# EAGLE design Wii U GamePad (EAGLE 6.2)
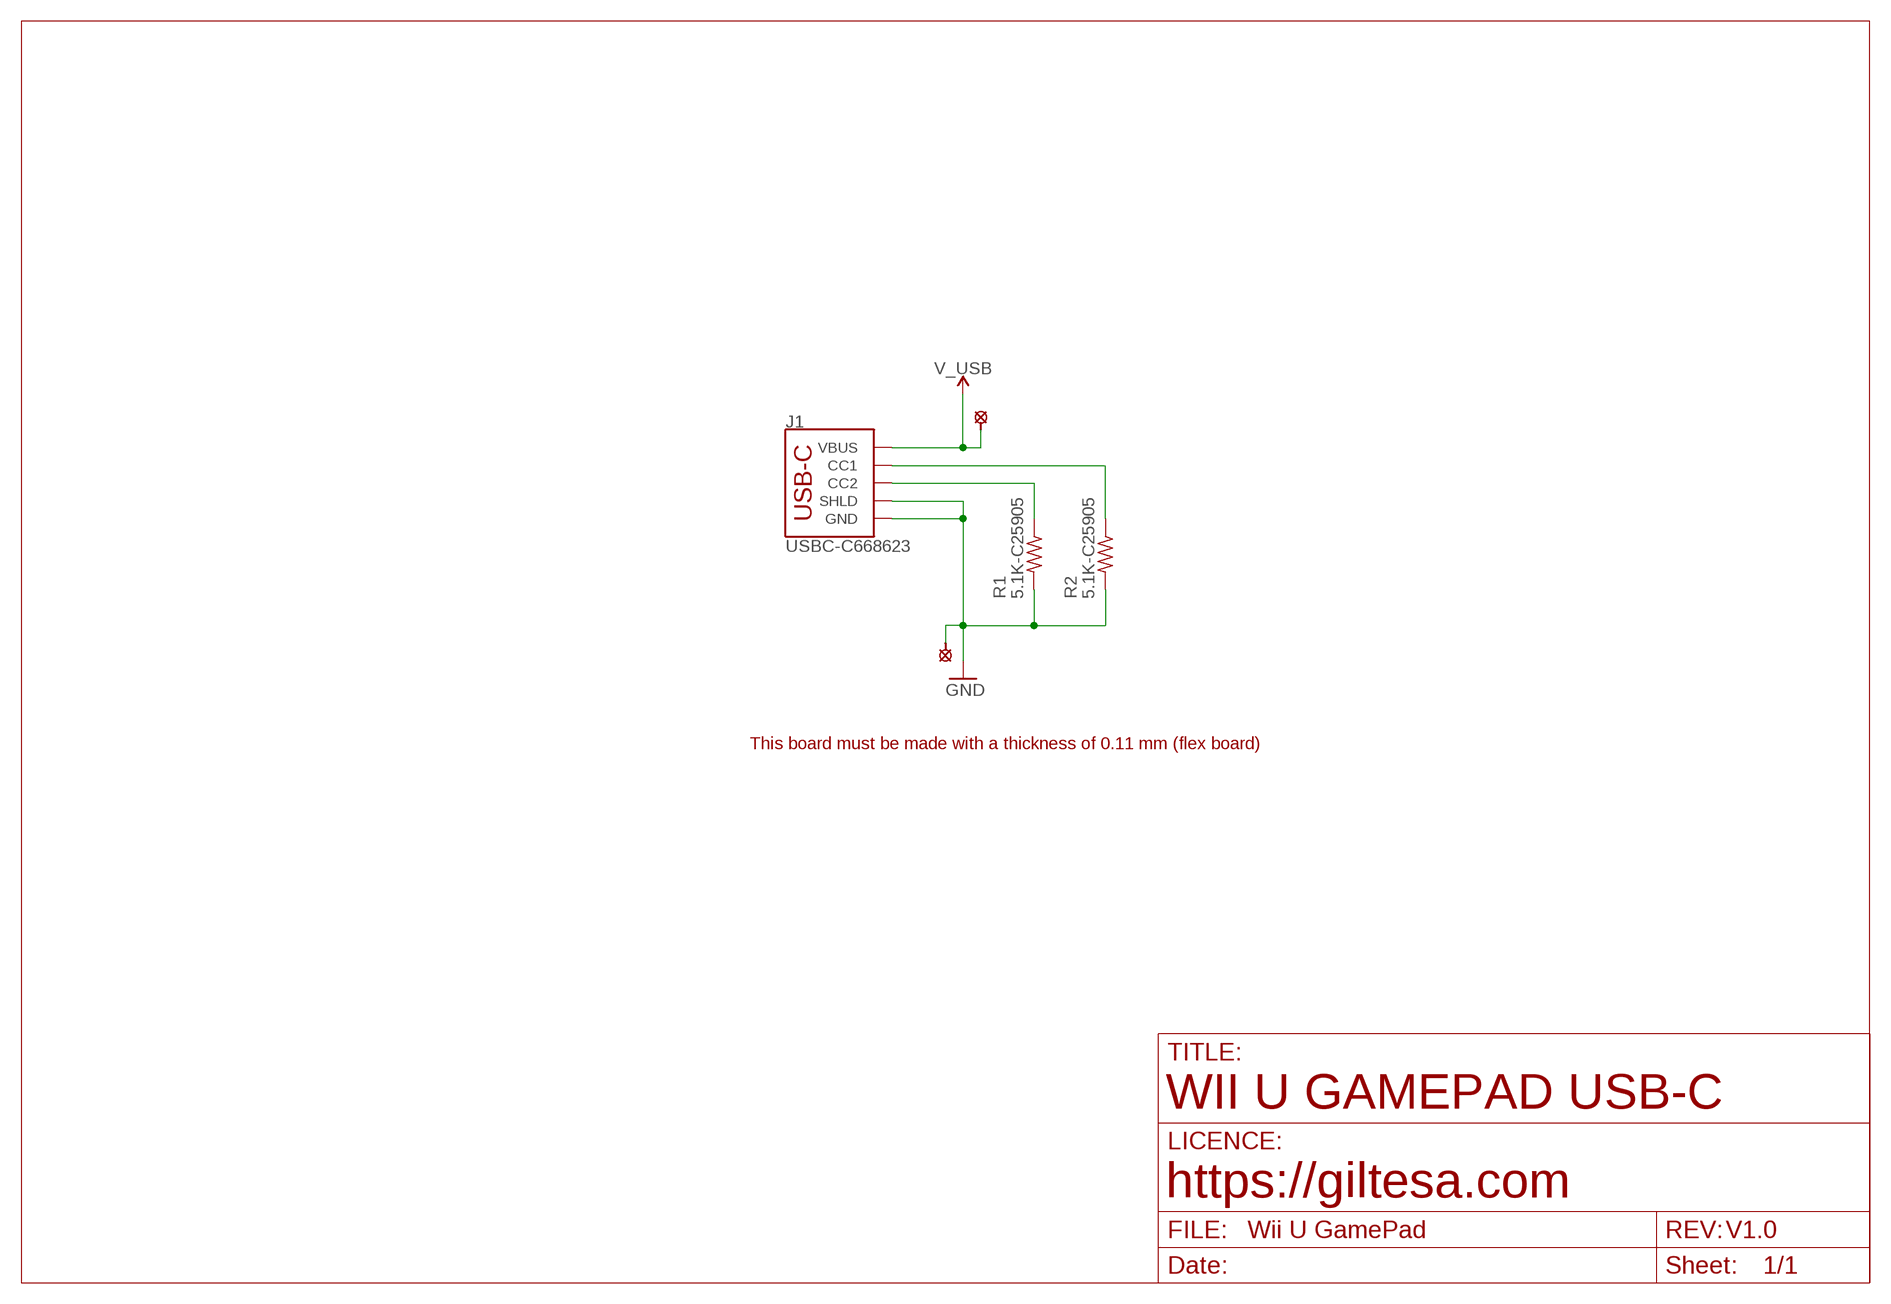
[diagram p0: schematic, sheet 1]

## Parts
J1  USBC-C668623  USB-C_6P_WIIU  [USB-C_6P_SMD_WIIU]
R1  5.1K-C25905  R0402  [R0402]
R2  5.1K-C25905  R0402  [R0402]
U$1  PAD_1.7  [PAD_1.7]
U$2  PAD_1.7  [PAD_1.7]

## Nets
CC1: J1.A5(CC1) R2.1
CC2: J1.B5(CC2) R1.1
GND: J1.A12-GND(GND) J1.B12-GND(GND) J1.SHLD R1.2 R2.2 U$2.P$1
V_USB: J1.A9-VBUS(VBUS) J1.B9-VBUS(VBUS) U$1.P$1

## Notes on the sheet
- This board must be made with a thickness of 0.11 mm (flex board)
- WII U GAMEPAD USB-C
- https://giltesa.com
- V1.0

## Library data of the parts
J1 = ,giltesa:USB-C_6P
R1 R2 = ,giltesa:R0402
U$1 U$2 = ,giltesa:PAD

## Net classes
1 power: width 0.61 mm, drill 0.406 mm, clearance 0.203 mm
2 gnd: width 0.305 mm, drill 0.406 mm, clearance 0.203 mm
3 power usb: width 0.508 mm, drill 0.406 mm, clearance 0.203 mm

## Board
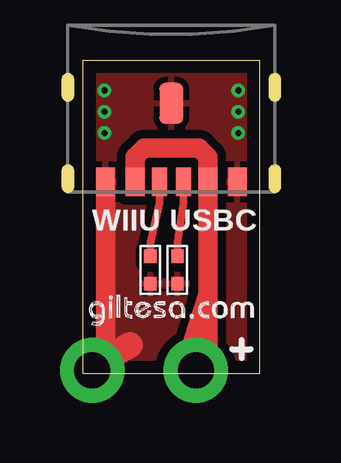
[diagram p1: board, top side]
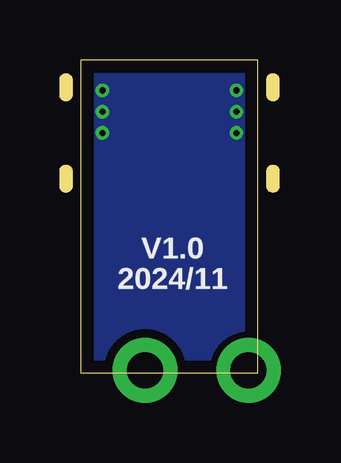
[diagram p2: board, bottom side, seen from below]

Size 7.37 x 13.08 mm. Coordinates in mm from the lower left corner, seen from the top.
Outline: 0,13.08 7.37,13.08 7.37,0 0,0 0,13.08
Copper layers (1*16): Top 0.035mm / dielectric 1.6mm / Bottom 0.035mm
Design rules: minimum track width 6mil, minimum drill 12mil, track to track 6mil, track to pad 6mil, pad to pad 6mil, via to via 8mil, smd to smd 0mil, copper to edge 20mil, drill to drill 10mil, minimum pad ring 6mil, minimum via ring 6mil, stop-mask expansion 0mil, vias tented up to drill 100mil, thermal gap 10mil
tRestrict: 3 lines
bRestrict: 3 lines

### Footprints (pad centres in the part's own frame; a part is rotated, then mirrored left to right if it is on the bottom)
USB-C_6P_SMD_WIIU = smd 0.635 x 1.2: A5 -0.5,2.034; B5 0.5,2.034 | smd 0.8 x 1.2: A9-VBUS 1.52,2.034; A12-GND 2.75,2.034; B9-VBUS -1.52,2.034; B12-GND -2.75,2.034 | smd 1 x 1.7: SHLD 0,-1.241
R0402 = smd 0.559 x 0.5: 1 -0.567,0; 2 0.567,0
PAD_1.7 = drill 1.5 pad 2.7: P$1 0,0

### Placement (x,y rotation side)
J1  3.68,10.03 180 top
R1  2.8,4.32 270 top
R2  3.93,4.32 270 top
U$1  4.7,0.13 0 top
U$2  0.38,0.13 0 top
U$11  [GILTESA.COM_MASK_7MM]  0.2,1.93 0 top

### Tracks (layer width: path | path; a pad name or v marks a point on that pad's centre or on a via)
CC1
  Top 0.305: J1.A5 4.18,7.11 3.94,5.46 R2.1
CC2
  Top 0.305: J1.B5 3.18,7.11 2.8,5.46 R1.1
GND  (via drill 0.25)
  Top 0.813: J1.A12-GND 0.93,0.68 U$2.P$1
  Top 1.067: 1.95,1.19 0.38,0.25
  other vias: 6.48,10.03 6.48,10.92 6.48,11.81 0.89,10.03 0.89,10.92 0.89,11.81
  pour Bottom (isolate 0.356): 9.87,-1.75 -2.51,-1.75 -2.51,15.14 9.87,15.14
  pour Top (isolate 0.356): 8.87,-0.75 -1.51,-0.75 -1.51,14.14 8.87,14.14
V_USB
  Top 0.813: 5.2,3.3 J1.B9-VBUS 5.2,9.02 4.83,9.4 2.54,9.4 2.16,9.02 J1.A9-VBUS | 5.2,3.3 5.2,0.63 U$1.P$1 | 5.2,3.3 4.19,0.13

### Text on the board
tPlace: WIIU USBC
bPlace: V1.0 | 2024/11